# Altium schematic sheet Title Page.SchDoc
size A4; Organization: BrickRed Systems; Address1: 2509 152nd Ave NE; Address2: Suite B; Address3: Redmond, WA 98052; SheetNumber: 1; SheetTotal: 6; PageSetup: Record=PageOptions|CenterHorizontal=True|CenterVertical=True|PrintScale=1.00|XCorrection=1.00|YCorrection=1.00|PrintKind=1|BorderSize=5000000|LeftOffset=0|BottomOffset=0|Orientation=2|PaperLength=1000|PaperWidth=1000|Scale=100|PaperSource=7|PrintQuality=600|MediaType=1|DitherType=10|PaperKind=Letter|PrintScaleMode=1
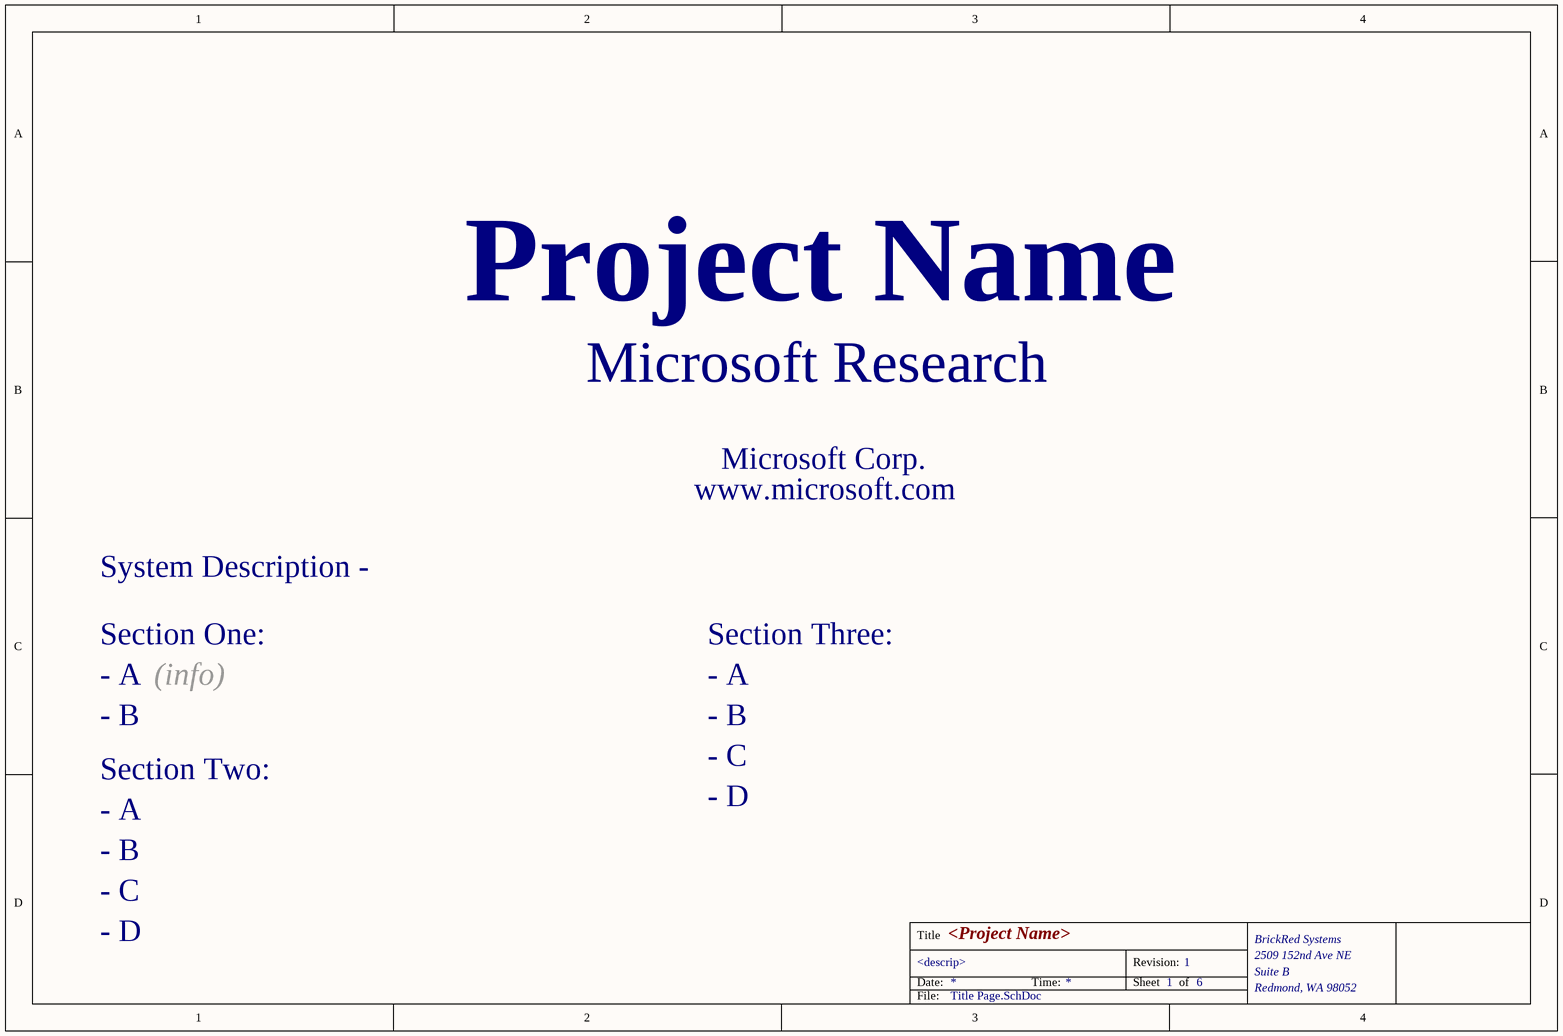
[diagram p0: Title Page.SchDoc]

## Notes on the sheet
- Project Name
- Microsoft Research
- www.microsoft.com
- Microsoft Corp.
- System Description -
- Section One:
- Section Three:
- - A
- (info)
- - B
- Section Two:
- - C
- - D
- Title
- Date:
- <descrip>
- <Project Name>
- Time:
- Revision:
- Sheet
- of
- 1
- File: